# EasyEDA Pro project ProPrj_picoballoon-tracker-v2_2025-12-21.epro, board PCB6
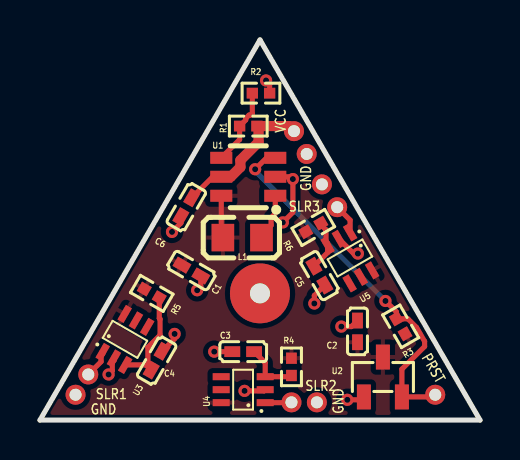
[diagram p7: board, top side]
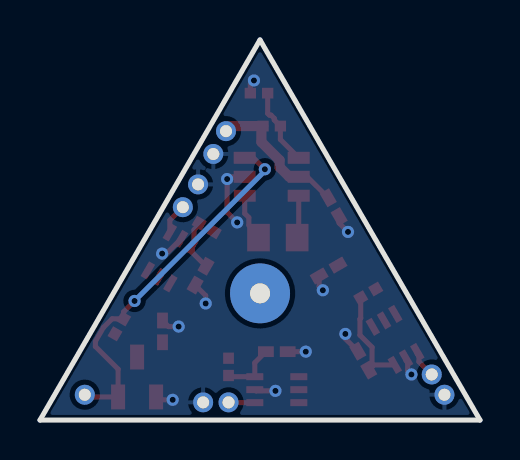
[diagram p8: board, bottom side, seen from below]

Outline 22 x 19.05 mm; copper layers: Top Layer, Bottom Layer. Coordinates in mm from the lower left corner of the outline.
Outline path: 0,0 22,0 11,19.05 0,0
Stack: Top Layer 0.035mm / Dielectric1 0.91mm FR4 er 4.5 / Bottom Layer 0.035mm

## Design rules (mm)
template: JLCPCB Capability(Two Layers Board)
spacing copperThickness1oz (default): track to track 0.102, other pairs 0.152 to 0.3
spacing copperThickness2oz: track to track 0.203, other pairs 0.152 to 0.3
track width copperThickness1oz (default): min 0.127, default 0.254, max 2.54
track width copperThickness2oz: min 0.203, default 0.254, max 2.54
differential pair differentialPair (default): width min 0.127, default 0.254, max 2.54; gap min 0.152, default 0.152
via viaSize (default): diameter min 0.5, default 0.61, max 10; hole min 0.3, default 0.305, max 6.3

## Placement (name value [footprint] x y rotation side)
C1  4.7uF  [C0402]  7.57 7.49 150 top
C2  100nF  [C0402]  15.88 4.44 90 top
C3  100nF  [C0402]  10.16 3.43 0 top
C4  100nF  [C0402]  5.83 2.98 240 top
C5  100nF  [C0402]  13.97 7.24 120 top
C6  10uF  [C0402]  7.31 10.67 60 top
L1  4.7uH  [L0805]  10.11 9.14 0 top
NOREF  -  [Pad_e16]  2.41 2.29 0 top
NOREF#2  -  [Pad_e18]  14.86 10.67 0 top
NOREF#3  -  [Pad_e108]  11 6.35 0 top
NOREF#4  -  [Pad_e20]  13.84 0.89 0 top
NOREF#5  -  [Pad_e21]  14.1 11.81 0 top
NOREF#6  -  [Pad_e241]  19.76 1.27 0 top
NOREF#7  -  [Pad_e106]  13.34 13.33 0 top
NOREF#8  -  [Pad_e19]  1.78 1.27 0 top
NOREF#9  -  [Pad_e107]  12.7 14.48 0 top
NOREF#10  -  [Pad_e17]  12.57 0.89 0 top
R1  976kΩ  [R0402]  10.41 14.73 0 top
R2  562kΩ  [R0402]  11.05 16.38 180 top
R3  10kΩ  [R0402]  18.03 4.7 120 top
R4  47kΩ  [R0402]  12.57 2.67 90 top
R5  47kΩ  [R0402]  5.59 6.35 150 top
R6  47kΩ  [R0402]  13.66 9.65 210 top
U1  MCP1640T-I/CHY  [SOT-23-6_L2.9-W1.6-P0.95-LS2.8-BR]  10.41 12.19 0 top
U2  APX803L20-23SA-7  [SOT-23-3_L2.9-W1.3-P1.90-LS2.4-BR]  17.15 2.16 270 top
U3  LM66100DCKR  [SC-70-6_L2.0-W1.3-P0.65-LS2.1-BL]  4.25 4.04 330 top
U4  LM66100DCKR  [SC-70-6_L2.0-W1.3-P0.65-LS2.1-BL]  10.16 1.52 90 top
U5  LM66100DCKR  [SC-70-6_L2.0-W1.3-P0.65-LS2.1-BL]  15.49 8.13 210 top

## Footprints (pads in the part's own frame, mm; a bottom-side part is the same pattern mirrored in y, then rotated)
C0402
  rect 0.79x0.54 smd: 1(-0.545,0) 2(0.545,0)
L0805
  rect 1.133x1.377 smd: 1(-0.966,0) 2(0.966,0)
Pad_e16
  round 1 hole 0.6: 1(0,0)
Pad_e17
  round 1 hole 0.6: 1(0,0)
Pad_e18
  round 1 hole 0.6: 1(0,0)
Pad_e19
  round 1 hole 0.6: 1(0,0)
Pad_e20
  round 1 hole 0.6: 1(0,0)
Pad_e21
  round 1 hole 0.6: 1(0,0)
Pad_e106
  round 1 hole 0.6: 1(0,0)
Pad_e107
  round 1 hole 0.6: 1(0,0)
Pad_e108
  round 3 hole 1: 1(0,0)
Pad_e241
  round 1 hole 0.6: 1(0,0)
R0402
  rect 0.566x0.54 smd: 1(-0.433,0) 2(0.433,0)
SC-70-6_L2.0-W1.3-P0.65-LS2.1-BL
  rect 0.35x0.85 smd: 1(-0.65,-1.1) 2(0,-1.1) 3(0.65,-1.1) 4(0.65,1.1) 5(0,1.1) 6(-0.65,1.1)
SOT-23-3_L2.9-W1.3-P1.90-LS2.4-BR
  rect 1.25x0.7 smd: 1(1,-0.95) 2(1,0.95) 3(-1,0)
SOT-23-6_L2.9-W1.6-P0.95-LS2.8-BR
  rect 1.1x0.6 smd: 1(1.35,-0.95) 2(1.35,0) 3(1.35,0.95) 4(-1.35,0.95) 5(-1.35,0) 6(-1.35,-0.95)

## Nets
GND: C1.1 C2.2 C3.1 C4.1 C5.1 C6.1 NOREF#4.1 NOREF#5.1 NOREF#7.1 NOREF#8.1 R2.1 U1.2 U2.1 U3.2 U4.2 U5.2
VCC: C6.2 NOREF#9.1 R1.2 U1.5
VIN: C1.2 C2.1 L1.1 R3.1 R4.2 R5.2 R6.2 U1.6 U2.3 U3.6 U4.6 U5.6
PRST: NOREF#6.1 R3.2 U1.3 U2.2
SLR1: NOREF.1 U3.1
SLR2: NOREF#10.1 U4.1
SLR3: NOREF#2.1 U5.1
$1N416: R1.1 R2.2 U1.4
$1N419: L1.2 U1.1
$1N912: C4.2 R5.1 U3.3
$1N938: C3.2 R4.1 U4.3
$1N951: C5.2 R6.1 U5.3

Pads without a net: NOREF#3 1; U3 4 5; U4 4 5; U5 4 5

## Via types
v1: diameter 0.61, hole 0.305, Top Layer to Bottom Layer, 15 vias

## Routing (per net, layer and track width the routed paths; a pad name or vN(x,y) marks a point on that pad's centre or on a via; arc(x,y) is an arc through that point)
GND: length 14
  Top Layer w0.254: v1(15.89,8.34) 15.68,8.34 U5.2 ; 6.11,3.45 6.73,4.08 v1(6.73,4.32) ; v1(3.43,2.29) 3.62,2.47 3.62,2.91 3.7,2.99 U3.2 ; v1(11.3,17.02) 11.48,16.84 R2.1 ; U2.1 16.05,1.02 v1(15.37,1.02) ; v1(15.07,4.69) 15.57,4.69 C2.2 ; v1(12.14,9.91) 12.64,10.41 v1(12.64,12.08) 12.53,12.19 U1.2 ; v1(13.72,5.84) 13.72,6.24 C5.1 ; v1(6.6,9.43) 7.04,9.87 C6.1 ; 8.04,7.22 8.04,6.69 v1(7.86,6.51) ; v1(10.23,1.46) 11.2,1.46 U4.2 ; v1(8.71,3.43) C3.1
VCC: length 7.5
  Top Layer w0.254: C6.2 8.64,12.19 U1.5
  Top Layer w0.508: NOREF#9.1 12.45,14.73 10.85,14.73 10.93,14.65 10.93,13.93 10.02,13.02 10.02,12.67 9.54,12.19 U1.5
VIN: length 2.1
  Top Layer w0.254: L1.1 9.06,9.22 U1.6
PRST: length 18.6
  Top Layer w0.254: v1(17.27,5.97) 17.82,5.42 R3.2 18.4,5.07 18.83,4.64 19.23,3.94 19.23,3.69 18.09,2.55 U2.2 19.65,1.16 NOREF#6.1 ; v1(10.76,12.57) 11.33,13.14 U1.3
  Bottom Layer w0.254: v1(10.76,12.57) 10.76,12.48 v1(17.27,5.97)
SLR1: length 1.4
  Top Layer w0.254: NOREF.1 3.05,2.93 3.05,3.23 3.13,3.31 U3.1
SLR2: length 1.3
  Top Layer w0.254: NOREF#10.1 12.56,0.87 U4.1
SLR3: length 1.5
  Top Layer w0.254: NOREF#2.1 15.51,10.02 15.51,9.41
$1N416: length 3.9
  Top Layer w0.254: R2.2 10.62,15.37 10.53,15.28 10.45,15.28 10.28,15.12 10.28,15.04 R1.1 9.98,14.06 U1.4
$1N419: length 2.1
  Top Layer w0.254: 11.19,9.4 11.56,9.77 11.56,10.15 11.76,10.35 U1.1
$1N912: length 5.1
  Top Layer w0.254: 5.4,2.67 5.4,3.65 6,4.26 6,5.06 5.96,5.11 5.96,6.13 ; 5.4,2.67 C4.2 ; 5.4,2.67 5.3,2.76 U3.3
$1N938: length 2.8
  Top Layer w0.254: R4.1 12.51,2.17 U4.3 11.26,2.87 C3.2
$1N951: length 2.7
  Top Layer w0.254: 13.96,9.87 14.3,9.53 14.3,8.93 14.38,8.85 14.38,8.39 13.7,7.71 ; 13.96,9.87 R6.1 ; 13.96,9.87 13.95,9.88

## Copper pours and planes (outline as drawn; the poured copper is in the pictures)
GND on Bottom Layer: 0,0 11,19.05 22,0
VIN on Top Layer: 11,19.05 0,0 22,0

## Text on the board
Top Silkscreen Layer: PRST | VCC | GND | SLR1 | SLR3 | SLR2
